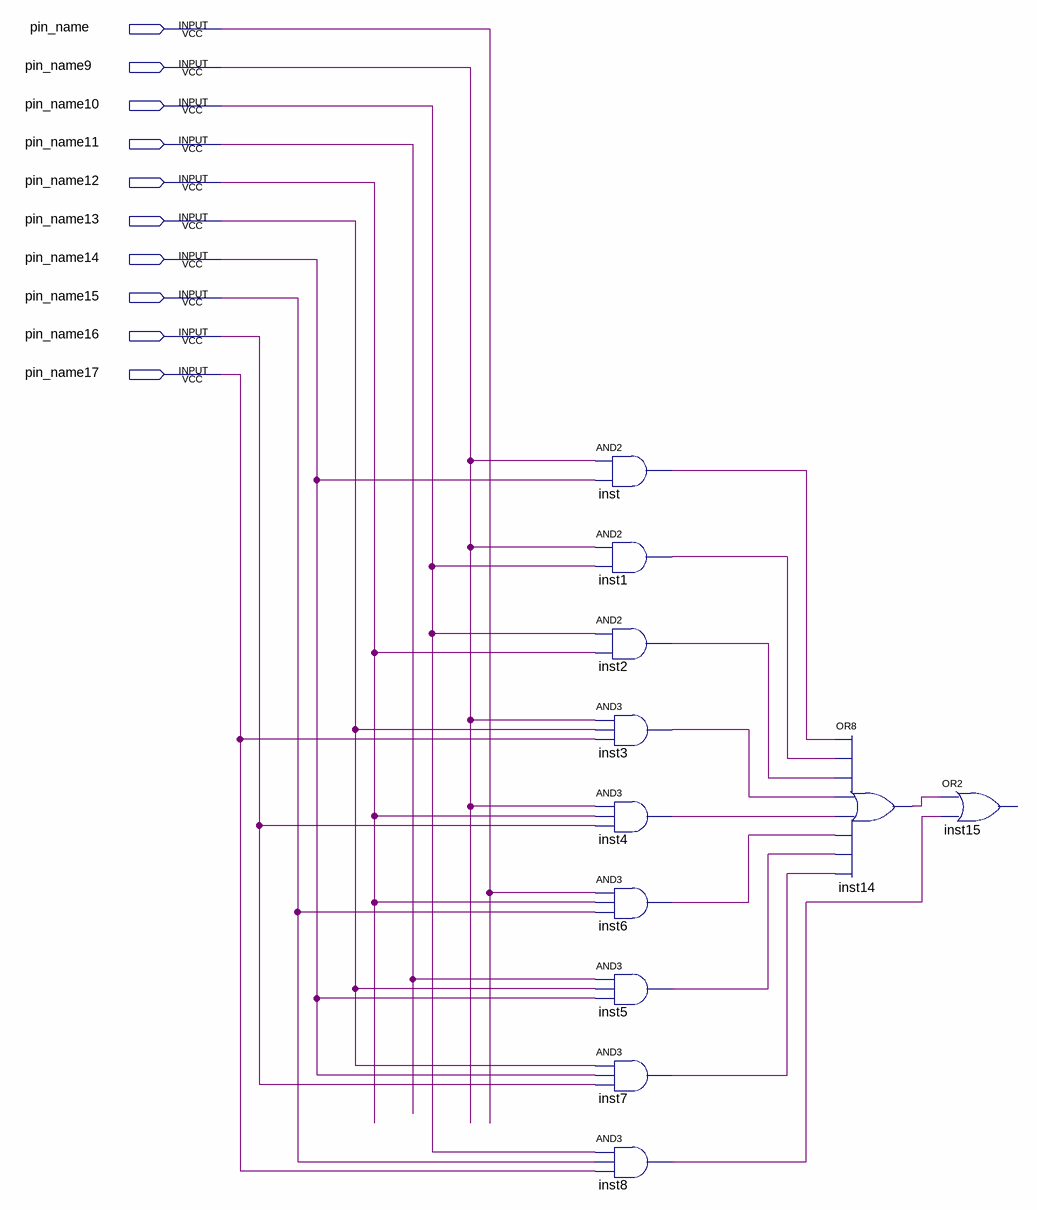
[diagram p0: schematic sheet]
// Quartus schematic saida_B.bdf as structural Verilog: 11 symbols, 10 pins
module saida_B (
  input  pin_name,
  input  pin_name9,
  input  pin_name10,
  input  pin_name11,
  input  pin_name12,
  input  pin_name13,
  input  pin_name14,
  input  pin_name15,
  input  pin_name16,
  input  pin_name17
);

  wire inst1_out, inst2_out, inst3_out, inst4_out, inst5_out, inst6_out, inst7_out, inst8_out, inst14_out,
       inst_out;

  and inst (inst_out, pin_name9, pin_name14);
  and inst1 (inst1_out, pin_name9, pin_name10);
  and inst2 (inst2_out, pin_name10, pin_name12);
  and inst3 (inst3_out, pin_name9, pin_name13, pin_name17);
  and inst4 (inst4_out, pin_name9, pin_name12, pin_name16);
  and inst6 (inst6_out, pin_name, pin_name12, pin_name15);
  and inst5 (inst5_out, pin_name11, pin_name13, pin_name14);
  and inst7 (inst7_out, pin_name13, pin_name14, pin_name16);
  and inst8 (inst8_out, pin_name10, pin_name15, pin_name17);
  or inst14 (inst14_out, inst_out, inst1_out, inst2_out, inst3_out, inst4_out, inst6_out, inst5_out, inst7_out);
  // OR2 inst15 has open pins: IN1=inst14_out, IN2=inst8_out, OUT=open
endmodule
